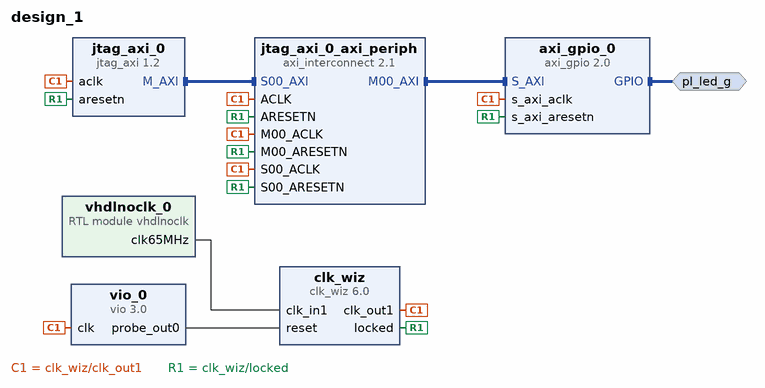
[diagram p0: block diagram of the top level]
# Vivado block design design_1, xc7z007sclg225-1, Vivado 2020.2
create_bd_design design_1

create_bd_intf_port -mode Master -vlnv xilinx.com:interface:gpio_rtl:1.0 pl_led_g

create_bd_cell -type ip -vlnv xilinx.com:ip:axi_gpio:2.0 axi_gpio_0
set_property -dict {CONFIG.GPIO_BOARD_INTERFACE pl_led_g CONFIG.USE_BOARD_FLOW true} [get_bd_cells axi_gpio_0]
create_bd_cell -type ip -vlnv xilinx.com:ip:jtag_axi:1.2 jtag_axi_0
create_bd_cell -type ip -vlnv xilinx.com:ip:axi_interconnect:2.1 jtag_axi_0_axi_periph
set_property -dict {CONFIG.NUM_MI 1} [get_bd_cells jtag_axi_0_axi_periph]
create_bd_cell -type ip -vlnv xilinx.com:ip:clk_wiz:6.0 clk_wiz
set_property -dict [list \
  CONFIG.CLKIN1_JITTER_PS 153.84 \
  CONFIG.CLKOUT1_JITTER 147.748 \
  CONFIG.CLKOUT1_PHASE_ERROR 109.791 \
  CONFIG.MMCM_CLKFBOUT_MULT_F 15.000 \
  CONFIG.MMCM_CLKIN1_PERIOD 15.385 \
  CONFIG.MMCM_CLKIN2_PERIOD 10.0 \
  CONFIG.MMCM_CLKOUT0_DIVIDE_F 9.750 \
  CONFIG.PRIM_IN_FREQ 65 \
] [get_bd_cells clk_wiz]
create_bd_cell -type module -reference vhdlnoclk vhdlnoclk_0
create_bd_cell -type ip -vlnv xilinx.com:ip:vio:3.0 vio_0
set_property -dict {CONFIG.C_NUM_PROBE_IN 0} [get_bd_cells vio_0]

# ---- connections ----

connect_bd_intf_net [get_bd_intf_ports pl_led_g] [get_bd_intf_pins axi_gpio_0/GPIO]
connect_bd_intf_net [get_bd_intf_pins jtag_axi_0/M_AXI] [get_bd_intf_pins jtag_axi_0_axi_periph/S00_AXI]
connect_bd_intf_net [get_bd_intf_pins jtag_axi_0_axi_periph/M00_AXI] [get_bd_intf_pins axi_gpio_0/S_AXI]
connect_bd_net [get_bd_pins clk_wiz/clk_out1] \
  [get_bd_pins jtag_axi_0/aclk] [get_bd_pins jtag_axi_0_axi_periph/S00_ACLK] [get_bd_pins axi_gpio_0/s_axi_aclk] \
  [get_bd_pins jtag_axi_0_axi_periph/M00_ACLK] [get_bd_pins jtag_axi_0_axi_periph/ACLK] [get_bd_pins vio_0/clk]
connect_bd_net -net rst_clk_wiz_100M_peripheral_aresetn [get_bd_pins clk_wiz/locked] \
  [get_bd_pins jtag_axi_0/aresetn] [get_bd_pins jtag_axi_0_axi_periph/S00_ARESETN] [get_bd_pins axi_gpio_0/s_axi_aresetn] \
  [get_bd_pins jtag_axi_0_axi_periph/M00_ARESETN] [get_bd_pins jtag_axi_0_axi_periph/ARESETN]
connect_bd_net [get_bd_pins vhdlnoclk_0/clk65MHz] [get_bd_pins clk_wiz/clk_in1]
connect_bd_net [get_bd_pins vio_0/probe_out0] [get_bd_pins clk_wiz/reset]

# ---- address map ----
assign_bd_address -offset 0x40000000 -range 64K -target_address_space [get_bd_addr_spaces jtag_axi_0/Data] [get_bd_addr_segs axi_gpio_0/S_AXI/Reg]

validate_bd_design
save_bd_design
